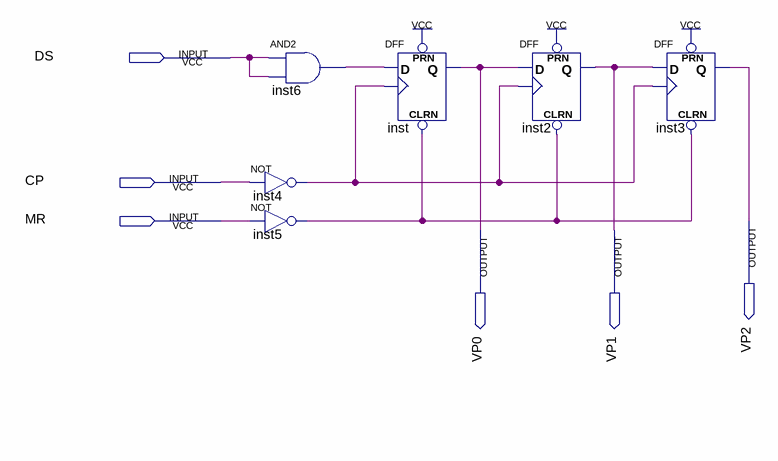
[diagram p0: schematic sheet]
// Quartus schematic Register_Serial_Paralelo.bdf as structural Verilog: 6 symbols, 6 pins
module Register_Serial_Paralelo (
  input  DS,
  input  CP,
  input  MR,
  output VP2,
  output VP0,
  output VP1
);

  wire inst4_out, inst5_out, inst6_out;

  not inst4 (inst4_out, CP);
  not inst5 (inst5_out, MR);
  and inst6 (inst6_out, DS, DS);
  DFF inst (.CLRN(inst5_out), .CLK(inst4_out), .D(inst6_out), .PRN(1'b1), .Q(VP0));
  DFF inst2 (.CLRN(inst5_out), .CLK(inst4_out), .D(VP0), .PRN(1'b1), .Q(VP1));
  DFF inst3 (.CLRN(inst5_out), .CLK(inst4_out), .D(VP1), .PRN(1'b1), .Q(VP2));
endmodule
